# Altium schematic sheet OUT.SchDoc
size 69 x 64 mm
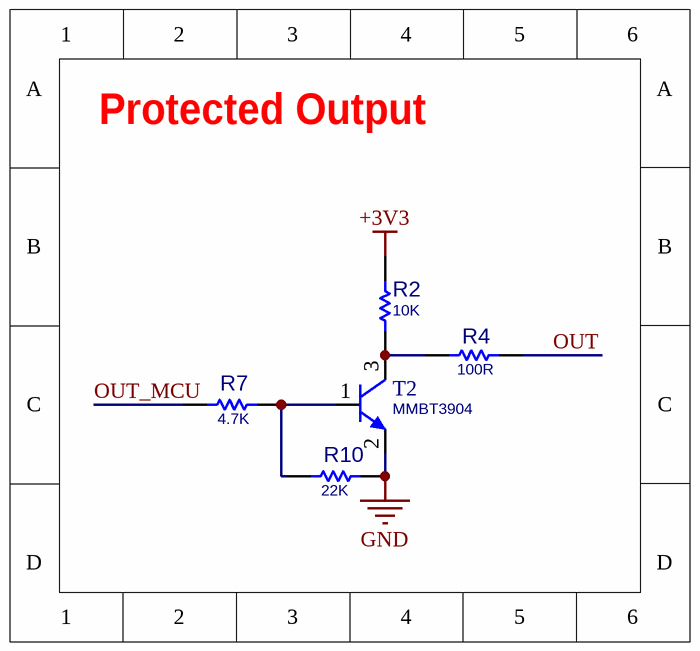
[diagram p0: OUT.SchDoc]

## Parts
R2  10K  [R0603]
R4  100R  [R0603]
R7  4.7K  [R0603]
R10  22K  [R0603]
T2  MMBT3904  [SOT23_3]

## Nets
+3V3: R2.2
GND: R10.1 T2.2(E)
OUT: R4.1
OUT_MCU: R7.2
NetR2_1: R2.1 R4.2 T2.3(C)
NetR7_1: R7.1 R10.2 T2.1(B)

## Notes on the sheet
- Protected Output

## Library data of the parts
R2 R4 R7 R10 = RES_SMD: RES, SMD; MANF_P#: RK73H1ETTP4701F; MANF: KOA SPEER; PARAM: 0.063W; DESC: DESCRIPTION; DIST#: MOUSER; PARAM2: 1%; ASSEMBLY: ASSEMBLY; PRICE: 100= 0.5$
  R2: VALUE: 10K
  R4: VALUE: 100R
  R7: VALUE: 4.7K
  R10: VALUE: 22K
T2 = NPN_MMBT3904_SOT23: BJT, NPN, 40v, 0.2A, SMD, SOT23; PARAM2: 250mW; MANF: Diodes, NXP, FAIRCHILD, ON; PARAM: 40v, 0.2A; MANF_P#: MMBT3904; VALUE: MMBT3904